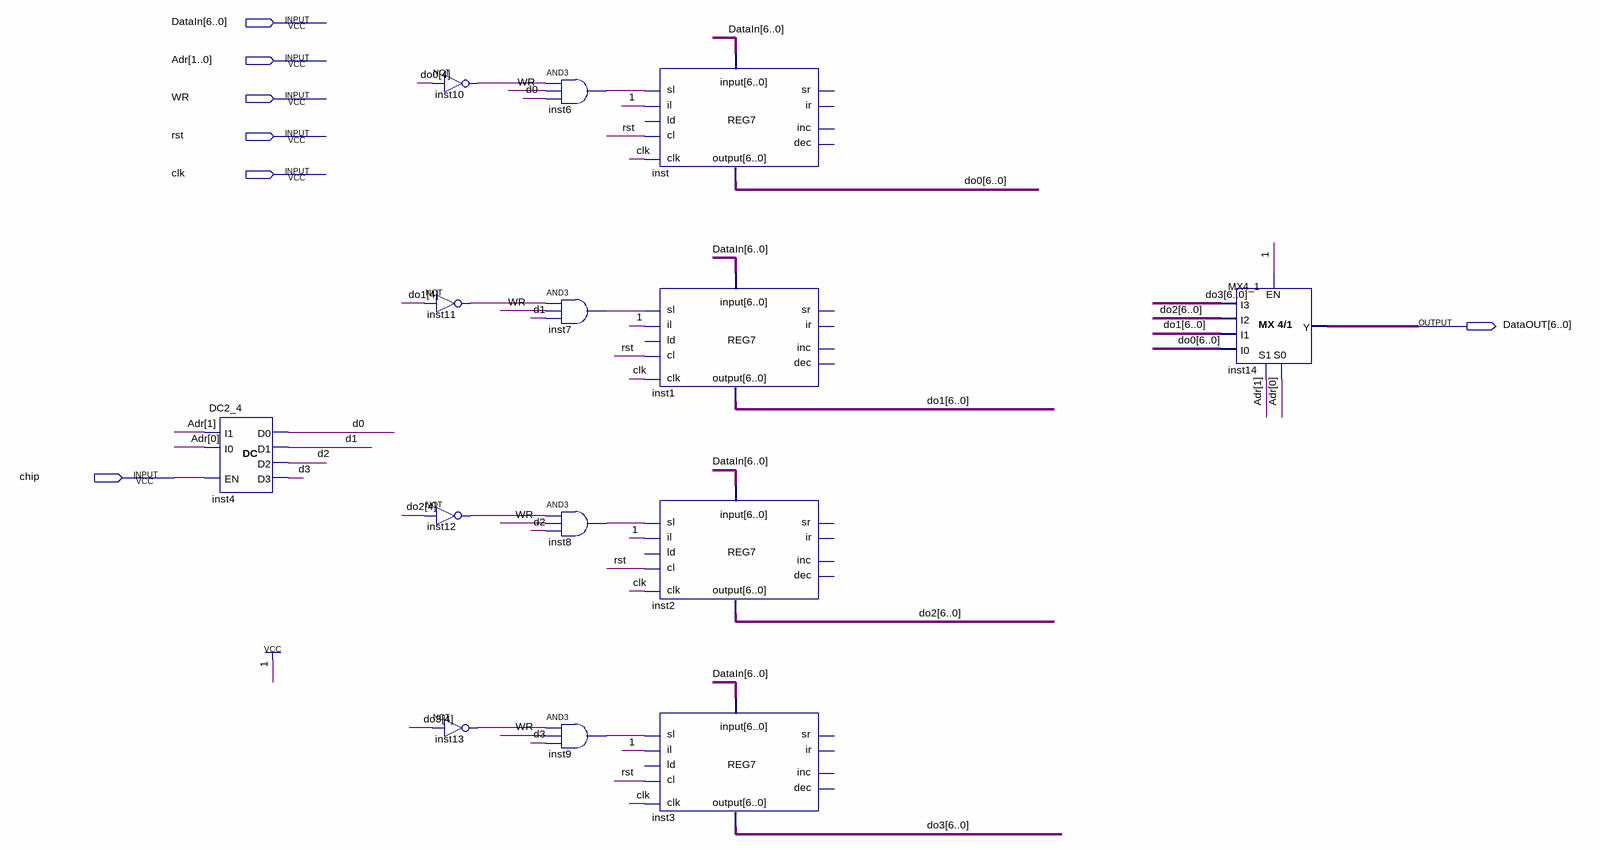
[diagram p0: schematic sheet]
// Quartus schematic memorija4.bdf as structural Verilog: 14 symbols, 7 pins
module memorija4 (
  input  [6:0] DataIn,
  input  [1:0] Adr,
  input  WR,
  input  rst,
  input  clk,
  input  chip,
  output [6:0] DataOUT
);

  wire d0, d1, d2, d3, inst6_out, inst7_out, inst8_out, inst9_out, inst10_out, inst11_out, inst12_out,
       inst13_out;
  wire [6:0] do0, do1, do2, do3;

  DC2_4 inst4 (.I0(Adr[0]), .I1(Adr[1]), .EN(chip), .D0(d0), .D1(d1), .D2(d2), .D3(d3));
  not inst10 (inst10_out, do0[4]);
  not inst11 (inst11_out, do1[4]);
  not inst12 (inst12_out, do2[4]);
  not inst13 (inst13_out, do3[4]);
  and inst6 (inst6_out, inst10_out, WR, d0);
  and inst7 (inst7_out, inst11_out, WR, d1);
  and inst8 (inst8_out, inst12_out, WR, d2);
  and inst9 (inst9_out, inst13_out, WR, d3);
  REG7 inst (
    .clk(clk), .\input (DataIn), .il(1'b1), .cl(rst), .sl(inst6_out), .\output (do0));  // open: ld, sr, ir, inc, dec
  REG7 inst1 (
    .clk(clk), .\input (DataIn), .il(1'b1), .cl(rst), .sl(inst7_out), .\output (do1));  // open: ld, sr, ir, inc, dec
  REG7 inst2 (
    .clk(clk), .\input (DataIn), .il(1'b1), .cl(rst), .sl(inst8_out), .\output (do2));  // open: ld, sr, ir, inc, dec
  REG7 inst3 (
    .clk(clk), .\input (DataIn), .il(1'b1), .cl(rst), .sl(inst9_out), .\output (do3));  // open: ld, sr, ir, inc, dec
  MX4_1 inst14 (.S1(Adr[1]), .S0(Adr[0]), .EN(1'b1), .I3(do3), .I2(do2), .I1(do1), .I0(do0), .Y(DataOUT));
endmodule
